# EasyEDA Pro project LeTalk智能语音音响.epro

# Schematic 主板
Board Name: 主板; Create Date: 2025-02-16; Page Name: 主控板; Project Name: LeTalk智能语音音响; Schematic Name: 主板; Update Date: 2025-02-16; Company: 延安大学西安创新学院; Drawed: 刘禛琪; Page Size: A4; Reviewed: 刘禛琪; Version: V8.0
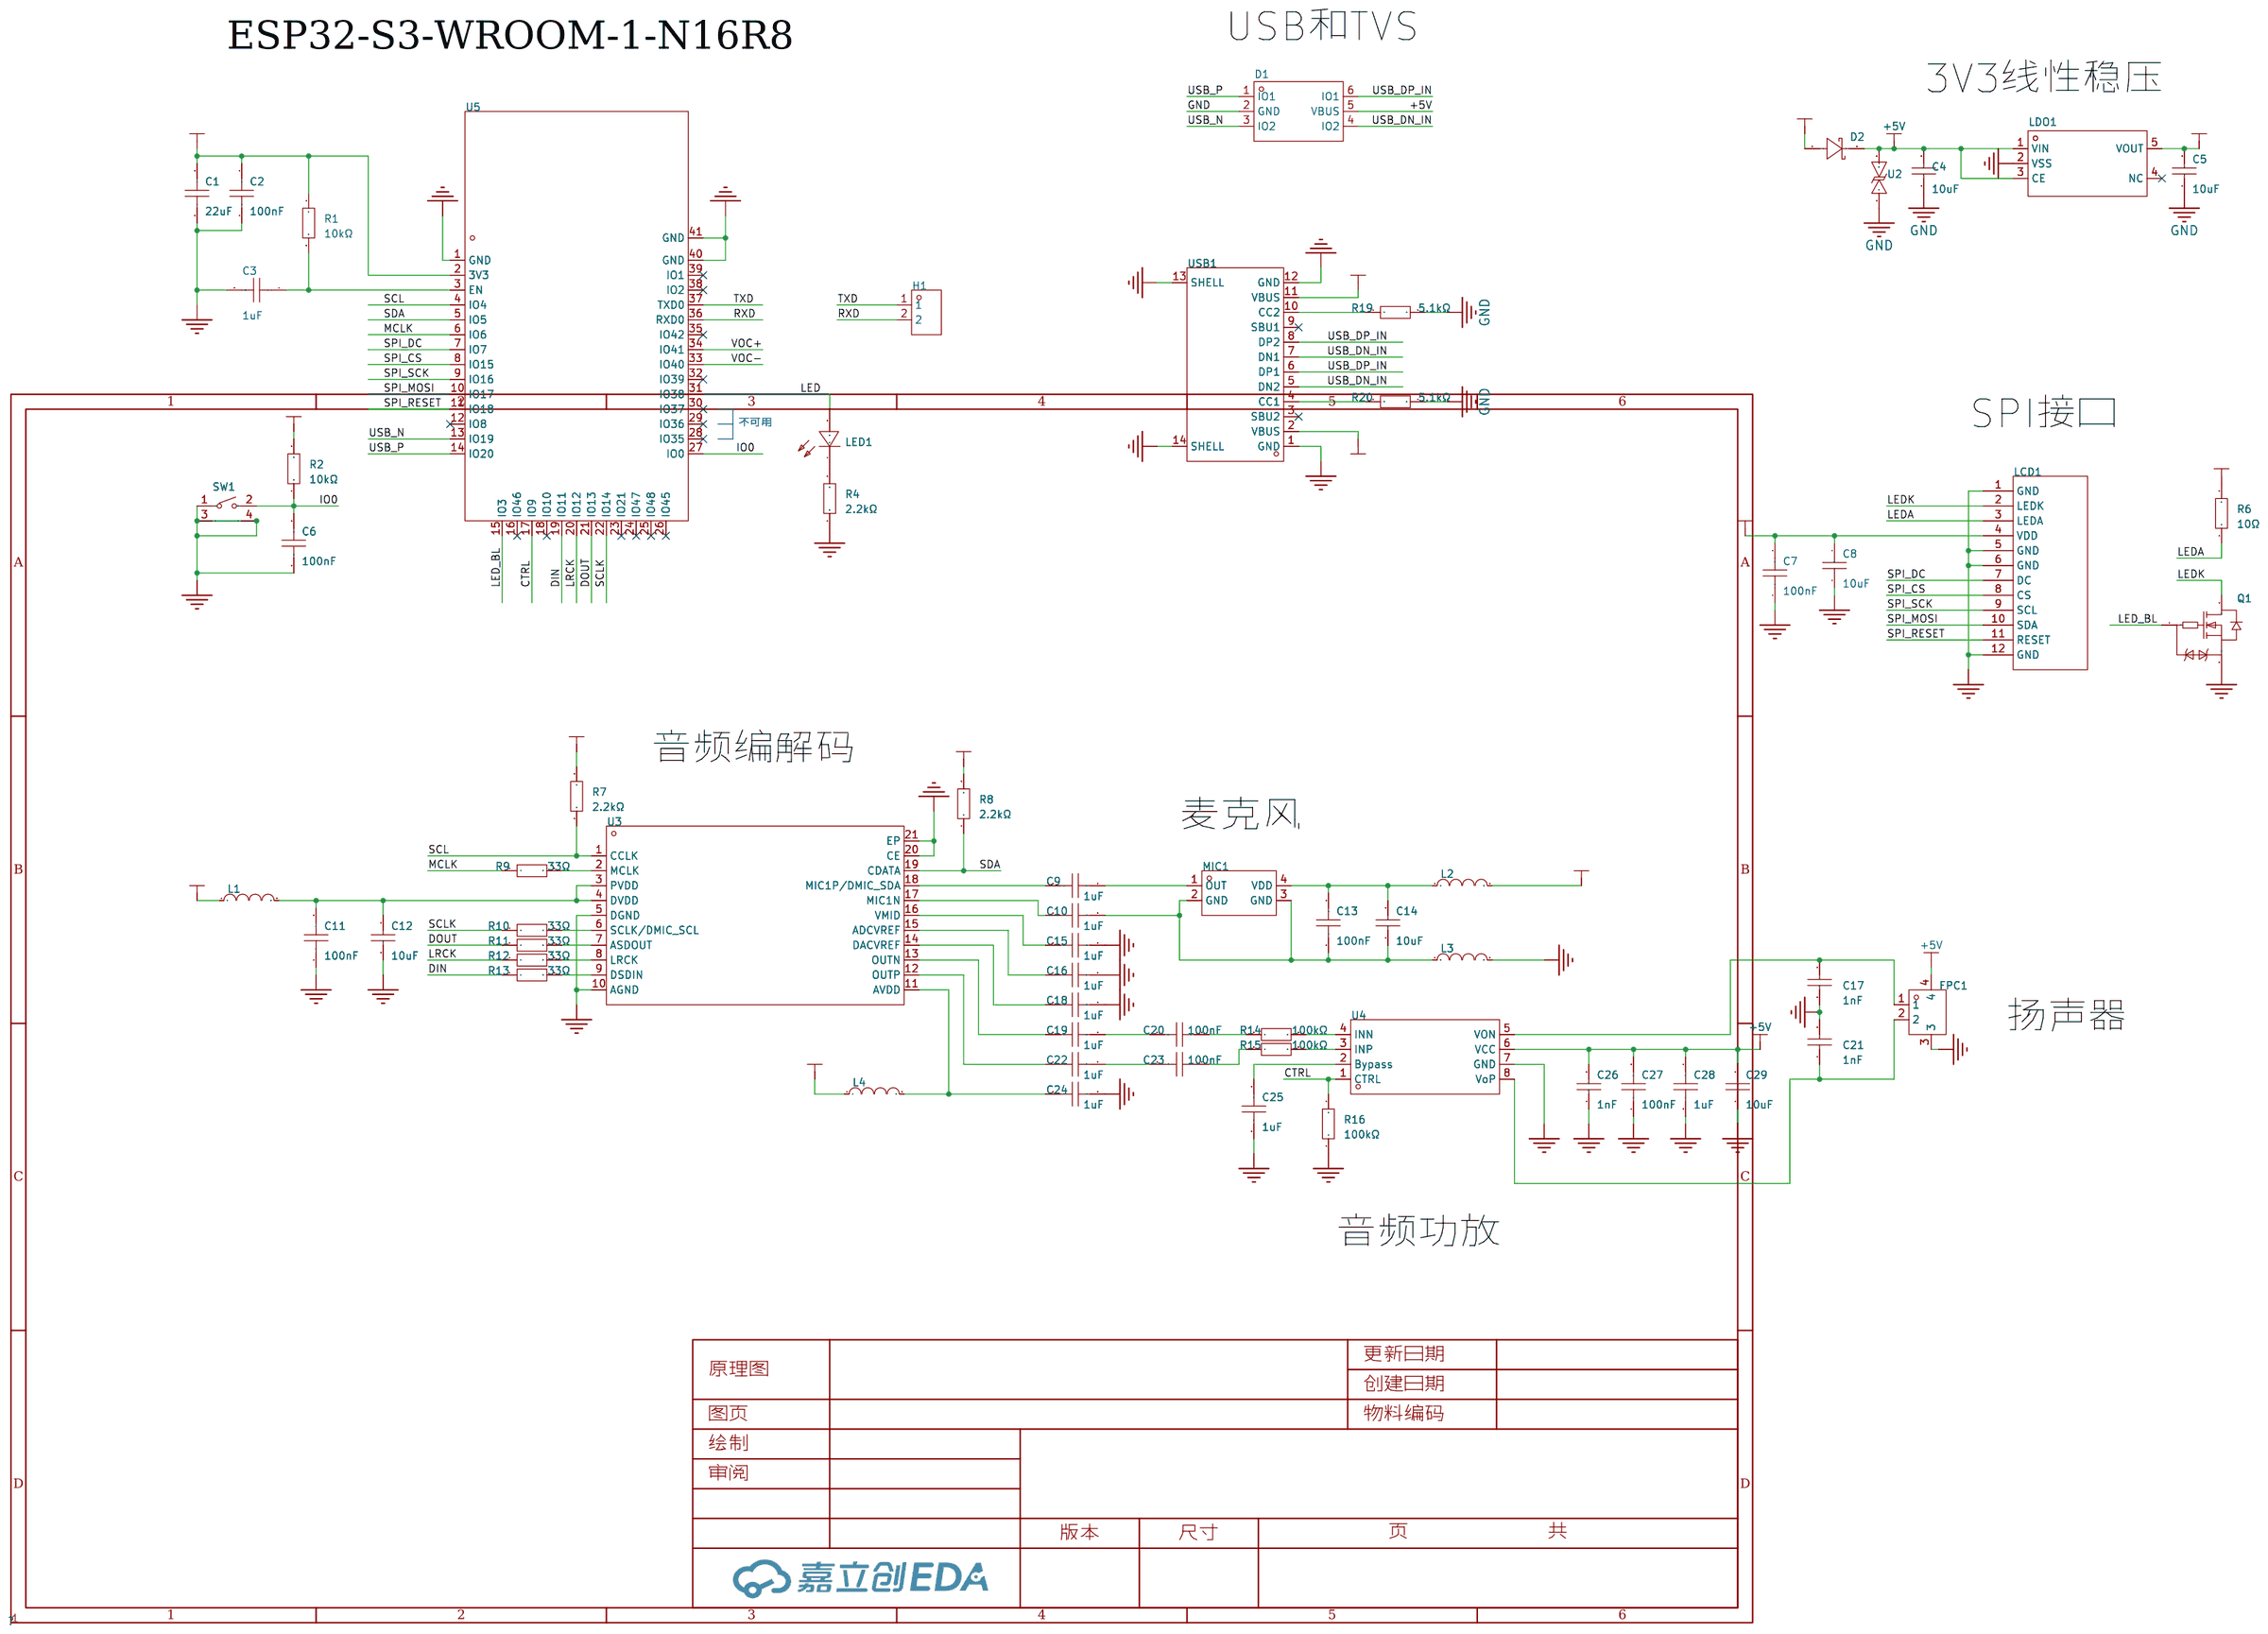
[diagram p0: schematic sheet]

## Parts
C1  22uF  [C0603]
C2  100nF  [C0402]
C3  1uF  [C0402]
C4  10uF  [C0402]
C5  10uF  [C0402]
C6  100nF  [C0402]
C7  100nF  [C0402]
C8  10uF  [C0402]
C9  1uF  [C0402]
C10  1uF  [C0402]
C11  100nF  [C0402]
C12  10uF  [C0402]
C13  100nF  [C0402]
C14  10uF  [C0402]
C15  1uF  [C0402]
C16  1uF  [C0402]
C17  1nF  [C0402]
C18  1uF  [C0402]
C19  1uF  [C0402]
C20  100nF  [C0402]
C21  1nF  [C0402]
C22  1uF  [C0402]
C23  100nF  [C0402]
C24  1uF  [C0402]
C25  1uF  [C0402]
C26  1nF  [C0402]
C27  100nF  [C0402]
C28  1uF  [C0402]
C29  10uF  [C0402]
D1  -  [SOT-23-6_L2.9-W1.6-P0.95-LS2.8-BL]
D2  B5819W  [SOD-123_L2.8-W1.8-LS3.7-FD-1]
FPC1  WAFER-MX1.25-2PWB  [CONN-SMD_2P-P1.25_XUNPU_WAFER-MX1.25-2PWB]
H1  PZ254V-11-02P  [HDR-TH_2P-P2.54-V-M]
L1  BLM15PX121SN1D  [L0402]
L2  BLM15PX121SN1D  [L0402]
L3  BLM15PX121SN1D  [L0402]
L4  BLM15PX121SN1D  [L0402]
LCD1  -  [YDP128H005-V3]
LDO1  ME6211C33M5G-N  [SOT-23-5_L3.0-W1.7-P0.95-LS2.8-BL]
LED1  TJ-S1706SW6TGLC6B-A5  [LED-SMD_L1.7-W0.6-RD]
MIC1  AP2718AT  [MIC-SMD_4P-L2.8-W1.9-P1.01-TL]
Q1  WNM6002-3/TR  [SOT-323-3_L2.0-W1.3-P1.30-LS2.1-BR]
R1  10kΩ  [R0402]
R2  10kΩ  [R0402]
R4  2.2kΩ  [R0402]
R6  10Ω  [R0402]
R7  2.2kΩ  [R0402]
R8  2.2kΩ  [R0402]
R9  33Ω  [R0402]
R10  33Ω  [R0402]
R11  33Ω  [R0402]
R12  33Ω  [R0402]
R13  33Ω  [R0402]
R14  100kΩ  [R0402]
R15  100kΩ  [R0402]
R16  100kΩ  [R0402]
R19  5.1kΩ  [R0402]
R20  5.1kΩ  [R0402]
SW1  GT-TC191A-H026-L60  [KEY-SMD_GT-TC191A-H026-L60]
U2  SYT01N05DWC  [DFN-2L_L1.0-W0.6-P0.65-BI-2]
U3  ES8311  [WQFN-20_L3.0-W3.0-P0.40-BL-EP1.7]
U4  NS4150B  [MSOP-8_L3.0-W3.0-P0.65-LS5.0-BL]
U5  ESP32-S3-WROOM-1-N16R8  [WIRELM-SMD_ESP32-S3-WROOM-1]
USB1  TYPE-C 16PIN 2MD(073)  [USB-C-SMD_TYPE-C-6PIN-2MD-073]

## Library data of the parts
C1 = CL10A226MP8NUNE: 温度系数:X5R;精度:±20%;额定电压:10V;容值:22uF;; LCSC Part Name: 22uF(226) ±20% 10V; Supplier Part: C86295; Manufacturer: SAMSUNG(三星); Supplier Footprint: 0603; JLCPCB Part Class: 扩展库; Datasheet: https://atta.szlcsc.com/upload/public/pdf/source/20170325/1490427882169.pdf; Supplier: LCSC; Temperature Coefficient: X5R; Tolerance: ±20%; Voltage Rated: 10V
C2 C6 = CC0402KRX7R7BB104: 容值:100nF;精度:±10%;额定电压:16V;材质(温度系数):X7R;; LCSC Part Name: 100nF ±10% 16V; Supplier Part: C60474; Manufacturer: YAGEO(国巨); Supplier Footprint: 0402; JLCPCB Part Class: 扩展库; Datasheet: https://atta.szlcsc.com/upload/public/pdf/source/20211223/9278FD768280B81DDBEF48FA36411A03.pdf; Supplier: LCSC; Tolerance: ±10%; Voltage Rated: 16V; Temperature Coefficient: X7R
C3 C9 C10 C15 C16 C18 C19 C22 C24 C25 C28 = CL05A105KA5NQNC: 容值:1uF;精度:±10%;额定电压:25V;材质(温度系数):X5R;; LCSC Part Name: 1uF ±10% 25V; Supplier Part: C52923; Manufacturer: SAMSUNG(三星); Supplier Footprint: 0402; JLCPCB Part Class: 基础库; Datasheet: https://atta.szlcsc.com/upload/public/pdf/source/20160218/1457707763339.pdf; Supplier: LCSC; Tolerance: ±10%; Voltage Rated: 25V; Temperature Coefficient: X5R
C4 C5 C8 C12 C14 C29 = CL05A106MQ5NUNC: 容值:10uF;精度:±20%;额定电压:6.3V;材质(温度系数):X5R;; LCSC Part Name: 10uF ±20% 6.3V; Supplier Part: C15525; Manufacturer: SAMSUNG(三星); Supplier Footprint: 0402; JLCPCB Part Class: 基础库; Datasheet: https://atta.szlcsc.com/upload/public/pdf/source/20220823/2B02EE04F8F211D38A52DCB16EB6BEBA.pdf; Supplier: LCSC; Tolerance: ±20%; Voltage Rated: 6.3V; Temperature Coefficient: X5R
C7 C11 C13 C20 C23 C27 = CC0402KRX7R7BB104: 容值:100nF;精度:±10%;额定电压:16V;材质(温度系数):X7R;; LCSC Part Name: 100nF ±10% 16V; Supplier Part: C60474; Manufacturer: YAGEO(国巨); Supplier Footprint: 0402; JLCPCB Part Class: Extended Part; Datasheet: https://atta.szlcsc.com/upload/public/pdf/source/20211223/9278FD768280B81DDBEF48FA36411A03.pdf; Supplier: LCSC; Tolerance: ±10%; Voltage Rated: 16V; Temperature Coefficient: X7R
C17 C21 C26 = CC0402KRX7R9BB102: 容值:1nF;精度:±10%;额定电压:50V;材质(温度系数):X7R;; LCSC Part Name: 1nF ±10% 50V; Supplier Part: C106205; Manufacturer: YAGEO(国巨); Supplier Footprint: 0402; JLCPCB Part Class: Extended Part; Datasheet: https://atta.szlcsc.com/upload/public/pdf/source/20181008/C309510_22F155564471FAF6A489F7D68F34234E.pdf; Supplier: LCSC; Tolerance: ±10%; Voltage Rated: 50V; Temperature Coefficient: X7R
D1 = USBLC6-2SC6: 极性:-;反向关断电压（典型值）:-;击穿电压（最小值）:-;箝位电压:-;峰值脉冲电流（10/1000us）:-;; Supplier Part: C2827654; Manufacturer: TECH PUBLIC(台舟); Supplier Footprint: SOT-23-6; JLCPCB Part Class: Extended Part; Datasheet: https://atta.szlcsc.com/upload/public/pdf/source/20210810/FBD75DE717D6D97BAC6DD7F2B5C09DCD.pdf; Supplier: LCSC
D2 = B5819W_C908224: 二极管配置:-;正向压降(Vf):900mV@3A;直流反向耐压(Vr):40V;整流电流:1A;; LCSC Part Name: 电压:40V 电流:1A; Supplier Part: C908224; Manufacturer: FUXINSEMI(富芯森美); Supplier Footprint: SOD-123; JLCPCB Part Class: 扩展库; Datasheet: https://atta.szlcsc.com/upload/public/pdf/source/20201027/C908224_73D10151B1A2DD88F16405F55CA93B30.pdf; Supplier: LCSC; Forward Voltage (Vf@If): 900mV@3A; Reverse Voltage (Vr): 40V; Rectified Current: 1A; Reverse Leakage Current (Ir): 1mA@40V
FPC1 = WAFER-MX1.25-2PWB: 插针结构:1x2P;间距:1.25mm;安装方式:卧贴;总PIN数:2P;排数:1;每排PIN数:2;额定电流:1A;工作温度范围:-25℃~+85℃;; LCSC Part Name: 1x2P 间距:1.25mm 卧贴; Supplier Part: C3029359; Manufacturer: XUNPU(讯普); Supplier Footprint: SMD,P=1.25mm,卧贴; JLCPCB Part Class: 扩展库; Datasheet: https://atta.szlcsc.com/upload/public/pdf/source/20220527/5ACBB683E384B6AD06743F272F933620.pdf; Supplier: LCSC; Pins Structure: 1x2P; Pitch: 1.25mm; Mounting Style: 卧贴; Number of Pins: 2P; Number of Rows: 1; Number of PINs Per Row: 2; Current Rating (Max): 1A; Operating Temperature Range: -25℃~+85℃
H1 = PZ254V-11-02P: 插针结构:1x2P;间距:2.54mm;行距:-;圆针/方针:方针;安装类型:直插;排数:单排;总PIN位数:2P;额定电流:-;额定电压:-;配合针长度:6mm;塑高:2.5mm;端接针长度:3mm;触头材质:黄铜;触头镀层:-;工作温度范围:-40℃~+105℃;颜色:黑色;; LCSC Part Name: 间距:2.54mm 1x2P 直插 方针; Supplier Part: C492401; Manufacturer: XFCN(兴飞); Supplier Footprint: 插件,P=2.54mm; JLCPCB Part Class: 扩展库; Datasheet: https://atta.szlcsc.com/upload/public/pdf/source/20200309/C492401_A812433581A9B211A7FFA413ADDFF0E5.pdf; Supplier: LCSC; Pin Structure: 1x2P; Pitch: 2.54mm; Circluar Pins/Square Pins: 方针; Mounting Type: 直插; Number of Rows: 单排; Number of Pins: 2P; Length of Mating Pin: 6mm; Insulation Height: 2.5mm; Length of End Connection Pin: 3mm; Contact Material: 黄铜; Operating Temperature Range: -40℃~+105℃; Color: 黑色
L1-L4 = BLM15PX121SN1D: 标称阻抗@测试频率:120Ω@100MHz;误差:±25%;直流电阻(DCR):55mΩ;; LCSC Part Name: 单路 0402磁珠 阻抗120Ω@100MHz; Supplier Part: C88970; Manufacturer: muRata(村田); Supplier Footprint: 0402; JLCPCB Part Class: 扩展库; Datasheet: https://atta.szlcsc.com/upload/public/pdf/source/20181120/C333978_3E581FB55966932B05020139ABDE8E01.pdf; Supplier: LCSC; Impedance @ Frequency: 120Ω@100MHz; Tolerance: ±25%; DC Resistance: 55mΩ; Current Rating: 2A; Circuits: 1
LCD1 = YDP128H005-V3: 1.28"/GC9A01/240x240; Check: false
LDO1 = ME6211C33M5G-N: 输出类型:固定;输出极性:正;最大输入电压:6V;输出电压:3.3V;输出电流:500mA;电源纹波抑制比(PSRR):70dB;; Supplier Part: C82942; Manufacturer: MICRONE(南京微盟); Supplier Footprint: SOT-23-5; Datasheet: https://atta.szlcsc.com/upload/public/pdf/source/20170918/C82942_1505727073070976520.pdf; Supplier: LCSC; Output Type: 固定; Output Polarity: 正; Number of Outputs: 1; Maximum Input Voltage: 6V; Output Voltage: 3.3V; Dropout Voltage: 260mV@(200mA); Output Current: 500mA; Power Supply Rejection Ratio (PSRR): 70dB
LED1 = TJ-S1706SW6TGLC6B-A5: 发光颜色:蓝色;; LCSC Part Name: 蓝灯; Supplier Part: C273617; Manufacturer: TOGIALED(统佳); Supplier Footprint: 0603; JLCPCB Part Class: 扩展库; Datasheet: https://atta.szlcsc.com/upload/public/pdf/source/20180904/C273617_010B6E63EA0A9F3D2D95851617E75532.pdf; Supplier: LCSC; Emitted Color: 蓝色
MIC1 = AP2718AT: 方向:全指向;信噪比:57dB;灵敏度:-42dB;阻抗:220Ω;; Supplier Part: C918197; Manufacturer: ALLPOWER(铨力); Supplier Footprint: SMD-4P,1.9x2.8mm; JLCPCB Part Class: 扩展库; Datasheet: https://atta.szlcsc.com/upload/public/pdf/source/20201117/C918197_916D2310AF560C68E9F1DD4012181D7B.pdf; Supplier: LCSC; Direction: 全指向; Supply Voltage: 1.6V~3.6V; Current Consumption: 95uA; SNR(Signal to Noise Ratio): 57dB; Sensitivity: -42dB; Impedance: 220Ω
Q1 = WNM6002-3/TR: 类型:1个N沟道;漏源电压(Vdss):60V;连续漏极电流(Id):300mA;导通电阻(RDS(on)@Vgs,Id):1.7Ω@4.5V,0.2A;功率(Pd):270mW;阈值电压(Vgs(th)@Id):800mV@250uA;; LCSC Part Name: 1个N沟道 耐压:60V 电流:300mA; Supplier Part: C501342; Manufacturer: WILLSEMI(韦尔); Supplier Footprint: SOT-323-3; JLCPCB Part Class: 扩展库; Datasheet: https://atta.szlcsc.com/upload/public/pdf/source/20200324/C501342_29E9D9C6E1199381F55B20D6C6C9F64A.pdf; Supplier: LCSC; Type: 1个N沟道; Drain Source Voltage (Vdss): 60V; Continuous Drain Current (Id): 300mA; Drain Source On Resistance (RDS(on)@Vgs,Id): 1.7Ω@4.5V,0.2A; Power Dissipation (Pd): 270mW; Gate Threshold Voltage (Vgs(th)@Id): 800mV@250uA; Total Gate Charge (Qg@Vgs): 1.2nC@10V; Input Capacitance (Ciss@Vds): 23.37pF; Reverse Transfer Capacitance (Crss@Vds): 5.2pF@25V; Operating Temperature: -55℃~+150℃; Configuration: 共源
R1 R2 = 0402WGF1002TCE: 电阻类型:厚膜电阻;阻值:10kΩ;精度:±1%;功率:62.5mW;最大工作电压:50V;温度系数:±100ppm/℃;; LCSC Part Name: 10kΩ ±1% 62.5mW 厚膜电阻; Supplier Part: C25744; Manufacturer: UNI-ROYAL(厚声); Supplier Footprint: 0402; JLCPCB Part Class: 基础库; Datasheet: https://atta.szlcsc.com/upload/public/pdf/source/20200306/C422600_1E6D84923E4A46A82E41ADD87F860B5C.pdf; Supplier: LCSC; Type: 厚膜电阻; Tolerance: ±1%; Power(Watts): 62.5mW; Overload Voltage (Max): 50V; Temperature Coefficient: ±100ppm/℃; Operating Temperature Range: -55℃~+155℃
R4 R7 R8 = 0402WGF2201TCE: 电阻类型:厚膜电阻;阻值:2.2kΩ;精度:±1%;功率:62.5mW;最大工作电压:50V;温度系数:±100ppm/℃;; LCSC Part Name: 2.2kΩ ±1% 62.5mW 厚膜电阻; Supplier Part: C25879; Manufacturer: UNI-ROYAL(厚声); Supplier Footprint: 0402; JLCPCB Part Class: 基础库; Datasheet: https://atta.szlcsc.com/upload/public/pdf/source/20200306/C422600_1E6D84923E4A46A82E41ADD87F860B5C.pdf; Supplier: LCSC; Type: 厚膜电阻; Tolerance: ±1%; Power(Watts): 62.5mW; Overload Voltage (Max): 50V; Temperature Coefficient: ±100ppm/℃; Operating Temperature Range: -55℃~+155℃
R6 = 0402WGF100JTCE: 电阻类型:厚膜电阻;阻值:10Ω;精度:±1%;功率:62.5mW;最大工作电压:50V;温度系数:±200ppm/℃;; LCSC Part Name: 10Ω ±1% 62.5mW 厚膜电阻; Supplier Part: C25077; Manufacturer: UNI-ROYAL(厚声); Supplier Footprint: 0402; JLCPCB Part Class: 基础库; Datasheet: https://atta.szlcsc.com/upload/public/pdf/source/20200306/C422600_1E6D84923E4A46A82E41ADD87F860B5C.pdf; Supplier: LCSC; Type: 厚膜电阻; Tolerance: ±1%; Power(Watts): 62.5mW; Overload Voltage (Max): 50V; Temperature Coefficient: ±200ppm/℃; Operating Temperature Range: -55℃~+155℃
R9-R13 = 0402WGF330JTCE: 电阻类型:厚膜电阻;阻值:33Ω;精度:±1%;功率:62.5mW;最大工作电压:50V;温度系数:±100ppm/℃;; LCSC Part Name: 33Ω ±1% 62.5mW 厚膜电阻; Supplier Part: C25105; Manufacturer: UNI-ROYAL(厚声); Supplier Footprint: 0402; JLCPCB Part Class: 基础库; Datasheet: https://atta.szlcsc.com/upload/public/pdf/source/20200306/C422600_1E6D84923E4A46A82E41ADD87F860B5C.pdf; Supplier: LCSC; Type: 厚膜电阻; Tolerance: ±1%; Power(Watts): 62.5mW; Overload Voltage (Max): 50V; Temperature Coefficient: ±100ppm/℃; Operating Temperature Range: -55℃~+155℃
R14-R16 = RC0402FR-07100KL: 电阻类型:厚膜电阻;阻值:100kΩ;精度:±1%;功率:62.5mW;最大工作电压:50V;温度系数:±100ppm/℃;; LCSC Part Name: 厚膜电阻 100kΩ ±1% 62.5mW; Supplier Part: C60491; Manufacturer: YAGEO(国巨); Supplier Footprint: 0402; JLCPCB Part Class: 扩展库; Datasheet: https://atta.szlcsc.com/upload/public/pdf/source/20180927/C295883_E8D83085EA81BD7DE0B2B681138C15EE.pdf; Supplier: LCSC; Type: 厚膜电阻; Tolerance: ±1%; Power(Watts): 62.5mW; Overload Voltage (Max): 50V; Temperature Coefficient: ±100ppm/℃; Operating Temperature Range: -55℃~+155℃
R19 R20 = RMC04025.1K1%N: 阻值:5.1kΩ;精度:±1%;功率:62.5mW;; LCSC Part Name: 5.1kΩ ±1% 62.5mW; Supplier Part: C325521; Manufacturer: Tyohm(幸亚电阻); Supplier Footprint: 0402; JLCPCB Part Class: 扩展库; Datasheet: https://atta.szlcsc.com/upload/public/pdf/source/20190115/C325521_1EC5F156994D781C7E2B08432302F19F.pdf; Supplier: LCSC; Tolerance: ±1%; Power(Watts): 62.5mW
SW1 = GT-TC191A-H026-L60: 电路结构:单刀单掷;按钮形状:圆形按钮;作用力:1.8N;安装方式:卧贴;开关长度:2.2mm;开关宽度:4.5mm;开关高度:2.6mm;带支架:不带;触点电流:50mA;额定电压(DC):12V;绝缘电阻:100MΩ;带灯:无;机械寿命:10万次;; LCSC Part Name: 2.2*4.5*2.6mm 卧贴 轻触开关; Supplier Part: C2890363; Manufacturer: G-Switch(品赞); Supplier Footprint: SMD; JLCPCB Part Class: 扩展库; Datasheet: https://atta.szlcsc.com/upload/public/pdf/source/20210903/827026A73FC85D31E29B802EE66DB347.pdf; Supplier: LCSC; Circuit: 单刀单掷; Actuator Style: 圆形按钮; Operating Force: 1.8N; Mounting Style: 卧贴; Switch Length: 2.2mm; Switch Width: 4.5mm; Switch Height: 2.6mm; Strike Gundam: 不带; Contact Current: 50mA; Voltage Rating (DC): 12V; Insulation Resistance: 100MΩ; Actuator/Cap Color: 黑色; With Lamp: 无; Pin Style: SMD接片; Mechanical Life: 10万次; Operating Temperature: -30℃~+85℃
U2 = SYT01N05DWC: Supplier Part: C3151913; Manufacturer: silergy(矽力杰); Supplier Footprint: DFN1006; JLCPCB Part Class: 扩展库; Datasheet: https://atta.szlcsc.com/upload/public/pdf/source/20220628/9319FA8A9E353BCA4B9F968BBD562652.pdf; Supplier: LCSC
U3 = ES8311: Supplier Part: C962342; Manufacturer: Everest-semi(顺芯); Supplier Footprint: WQFN-20-EP(3x3); JLCPCB Part Class: 扩展库; Datasheet: https://atta.szlcsc.com/upload/public/pdf/source/20210630/C962342_E665EAE7274179BC7C5A390EC8AC685C.pdf; Supplier: LCSC
U4 = NS4150B_C189961: 功放类型:D类功放;输出功率:3Wx1@4Ω;; Supplier Part: C189961; Manufacturer: Nsiway(纳芯威); Supplier Footprint: MSOP-8; JLCPCB Part Class: 扩展库; Datasheet: https://atta.szlcsc.com/upload/public/pdf/source/20220916/DAE631F3909B9CBB38BDE76E3E6D5896.pdf; Supplier: LCSC; Type of Power Amplifier: D类功放; Output Power: 3Wx1@4Ω; Supply Voltage: 3V~5.25V
U5 = ESP32-S3-WROOM-1-N16R8: LCSC Part Name: 通用型Wi-Fi+低功耗蓝牙MCU模组; Supplier Part: C2913202; Manufacturer: ESPRESSIF(乐鑫); Supplier Footprint: SMD,18x25.5mm; JLCPCB Part Class: 扩展库; Datasheet: https://atta.szlcsc.com/upload/public/pdf/source/20220705/4E799F39581577F766659887F738A439.pdf; Supplier: LCSC
USB1 = TYPE-C 16PIN 2MD(073): 连接器类型:Type-C;标准:USB 3.1;公母:母;安装方式:卧贴;触点数量:16P;端口数量:1;额定电流 - 电源:5A;工作温度范围:-25℃~+85℃;; LCSC Part Name: Type-C 母 卧贴; Supplier Part: C2765186; Manufacturer: SHOU HAN(首韩); Supplier Footprint: SMD; JLCPCB Part Class: 扩展库; Datasheet: https://atta.szlcsc.com/upload/public/pdf/source/20211123/39B17C16241EAC15C5E277BDA434118E.pdf; Supplier: LCSC; Connector Type: Type-C; Standard: USB 3.1; Gender: 母; Mounting Style: 卧贴; Number of Contacts: 16P; Number of Ports: 1; Current Rating - Power (Max): 5A; Operating Temperature Range: -25℃~+85℃; Rated Voltage (Max): 5V; Connect-Disconnect Life: 5千次; Core Colour: 黑色

## Nets
+3V3: C1.2 C2.2 C5.2 C7.2 C8.2 L1.1 L2.2 L4.1 LCD1.4(VDD) LDO1.5(VOUT) R1.1 R2.2 R6.2 R7.2 R8.2 U5.2(3V3)
+5V: C4.2 C26.2 C27.2 C28.1 C29.2 D1.5(VBUS) D2.2(K) FPC1.4 LDO1.1(VIN) LDO1.3(CE) U2.2 U4.6(VCC)
GND: C1.1 C2.1 C3.2 C4.1 C5.1 C6.1 C7.1 C8.1 C11.1 C12.1 C15.2 C16.2 C17.1 C18.2 C21.2 C24.2 C25.2 C26.1 C27.1 C28.2 C29.1 D1.2(GND) FPC1.3 L3.2 LCD1.1(GND) LCD1.5(GND) LCD1.6(GND) LCD1.12(GND) LDO1.2(VSS) Q1.2(S) R4.2 R16.1 R19.2 R20.2 SW1.1 SW1.3 SW1.4 U2.1 U3.5(DGND) U3.10(AGND) U3.20(CE) U3.21(EP) U4.7(GND) U5.1(GND) U5.40(GND) U5.41(GND) USB1.1(GND) USB1.12(GND) USB1.13(SHELL) USB1.14(SHELL)
VBUS: D2.1(A) USB1.2(VBUS) USB1.11(VBUS)
CTRL: R16.2 U4.1(CTRL) U5.17(IO9)
DIN: R13.1 U5.19(IO11)
DOUT: R11.1 U5.21(IO13)
IO0: C6.2 R2.1 SW1.2 U5.27(IO0)
LED: LED1.2 U5.31(IO38)
LED_BL: Q1.1(G) U5.15(IO3)
LEDA: LCD1.3(LEDA) R6.1
LEDK: LCD1.2(LEDK) Q1.3(D)
LRCK: R12.1 U5.20(IO12)
MCLK: R9.1 U5.6(IO6)
RXD: H1.2 U5.36(RXD0)
SCL: R7.1 U3.1(CCLK) U5.4(IO4)
SCLK: R10.1 U5.22(IO14)
SDA: R8.1 U3.19(CDATA) U5.5(IO5)
SPI_CS: LCD1.8(CS) U5.8(IO15)
SPI_DC: LCD1.7(DC) U5.7(IO7)
SPI_MOSI: LCD1.10(SDA) U5.10(IO17)
SPI_RESET: LCD1.11(RESET) U5.11(IO18)
SPI_SCK: LCD1.9(SCL) U5.9(IO16)
TXD: H1.1 U5.37(TXD0)
USB_DN_IN: D1.4(IO2) USB1.5(DN2) USB1.7(DN1)
USB_DP_IN: D1.6(IO1) USB1.6(DP1) USB1.8(DP2)
USB_N: D1.3(IO2) U5.13(IO19)
USB_P: D1.1(IO1) U5.14(IO20)
VOC+: U5.34(IO41)
VOC-: U5.33(IO40)
$1N3371: C9.1 U3.18(MIC1P/DMIC_SDA)
$1N3372: C10.1 U3.17(MIC1N)
$1N3373: C15.1 U3.16(VMID)
$1N3374: C16.1 U3.15(ADCVREF)
$1N3375: C18.1 U3.14(DACVREF)
$1N3376: C19.1 U3.13(OUTN)
$1N3377: C22.1 U3.12(OUTP)
$1N3378: C24.1 L4.2 U3.11(AVDD)
$1N3384: R9.2 U3.2(MCLK)
$1N3385: C11.2 C12.2 L1.2 U3.3(PVDD) U3.4(DVDD)
$1N3387: R10.2 U3.6(SCLK/DMIC_SCL)
$1N3388: R11.2 U3.7(ASDOUT)
$1N3389: R12.2 U3.8(LRCK)
$1N3390: R13.2 U3.9(DSDIN)
$1N3393: C13.2 C14.2 L2.1 MIC1.4(VDD)
$1N3395: C9.2 MIC1.1(OUT)
$1N3413: R14.2 U4.4(INN)
$1N3415: R15.2 U4.3(INP)
$1N3417: C22.2 C23.2
$1N3418: C25.1 U4.2(Bypass)
$1N3429: C21.1 FPC1.2 U4.8(VoP)
$1N3430: C17.2 FPC1.1 U4.5(VON)
$1N5880: C19.2 C20.2
$1N5884: C20.1 R14.1
$1N5889: C23.1 R15.1
$1N5925: C10.2 C13.1 C14.1 L3.1 MIC1.2(GND) MIC1.3(GND)
$1N9910: R19.1 USB1.10(CC2)
$1N9913: R20.1 USB1.4(CC1)
$1N10459: LED1.1 R4.1
$1N10799: C3.1 R1.2 U5.3(EN)

Not connected (* = marked no-connect by the designer): LDO1 4(NC)*; U5 12(IO8)* 16(IO46)* 18(IO10)* 23(IO21)* 24(IO47)* 25(IO48)* 26(IO45)* 28(IO35)* 29(IO36)* 30(IO37)* 32(IO39)* 35(IO42)* 38(IO2)* 39(IO1)*; USB1 3(SBU2)* 9(SBU1)*

## Notes on the sheet
- USB和TVS
- ESP32-S3-WROOM-1-N16R8
- 3V3线性稳压
- 不可用
- SPI接口
- 音频编解码
- 麦克风
- 扬声器
- 音频功放

# Board PCB1
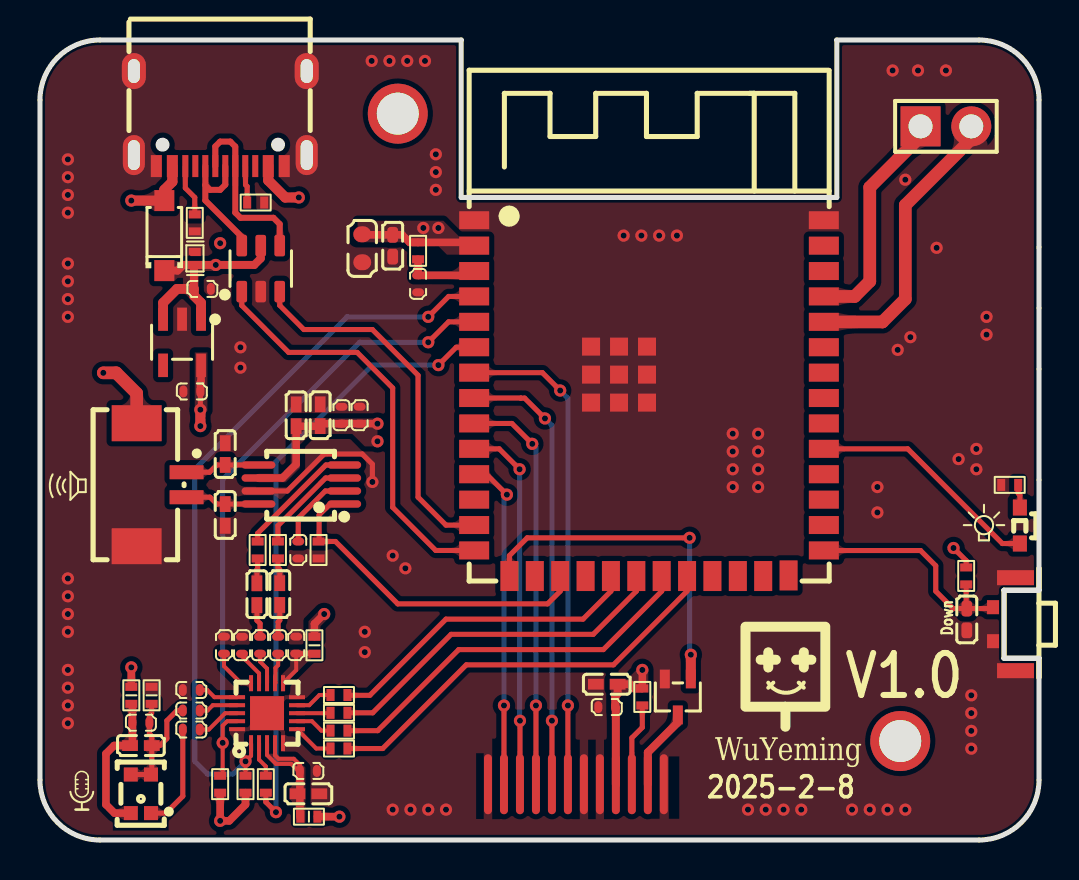
[diagram p1: board, top side]
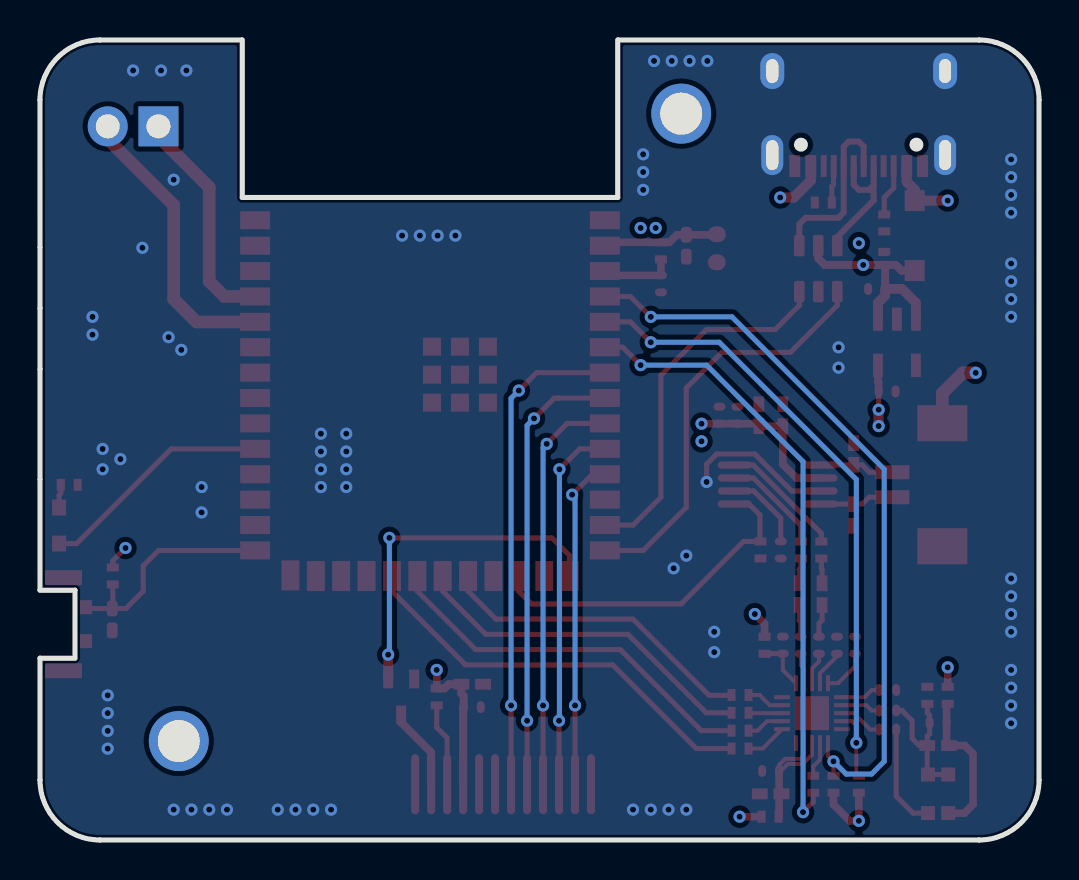
[diagram p2: board, bottom side, seen from below]

Outline 50 x 40 mm; copper layers: Top Layer, GND, VDD, Bottom Layer. Coordinates in mm from the lower left corner of the outline.
Outline path: 0,37 0,3 arc(0.88,0.88) 3,0 47,0 arc(49.12,0.88) 50,3 50,9.09 48.25,9.09 48.25,12.49 50,12.49 50,29.64 50,37 arc(49.12,39.12) 47,40 39.88,40 39.88,32.13 21.08,32.13 21.08,40 3,40 arc(0.88,39.12) 0,37
Stack: Top Layer 0.035mm 外层铜厚1oz / Dielectric1 0.2104mm 7628 RC49% 8.6mil / GND 0.035mm / Dielectric2 1.065mm 1.1mm H/HOZ Copper / VDD 0.035mm / Dielectric3 0.2104mm 7628 RC49% 8.6mil / Bottom Layer 0.035mm 外层铜厚1oz

## Design rules (mm)
template: 自定义配置
spacing copperThickness1oz (default): track to track 0.102, other pairs 0.152 to 0.3
spacing copperThickness2oz: track to track 0.203, other pairs 0.152 to 0.3
track width copperThickness1oz (default): min 0.127, default 0.254, max 2.54
track width copperThickness2oz: min 0.203, default 0.254, max 2.54
differential pair differentialPair (default): width min 0.127, default 0.254, max 2.54; gap min 0.152, default 0.152
via viaSize (default): diameter min 0.432, default 0.61, max 10; hole min 0.229, default 0.305, max 6.299

## Placement (name value [footprint] x y rotation side)
C1  22uF  [C0603]  16.13 29.59 90 top
C2  100nF  [C0402]  17.65 29.71 90 top
C3  1uF  [C0402#2]  18.92 27.81 270 top
C4  10uF  [C0402#2]  8.13 27.55 180 top
C5  10uF  [C0402#2]  7.6 22.43 0 top
C6  100nF  [C0402]  46.38 11.03 90 top
C7  100nF  [C0402#3]  28.37 7.79 0 top
C8  10uF  [C0402#2]  28.37 6.65 0 top
C9  1uF  [C0402#2]  7.57 5.52 180 top
C10  1uF  [C0402#2]  7.57 6.48 180 top
C11  100nF  [C0402#3]  13.43 2.31 180 top
C12  10uF  [C0402#2]  13.43 3.45 180 top
C13  100nF  [C0402#3]  5.05 4.72 180 top
C14  10uF  [C0402#2]  5.05 5.87 180 top
C15  1uF  [C0402#2]  7.57 7.5 180 top
C16  1uF  [C0402#2]  9.21 9.74 90 top
C17  1nF  [C0402#3]  9.27 19.3 270 top
C18  1uF  [C0402#2]  10.11 9.74 90 top
C19  1uF  [C0402#2]  11.02 9.74 90 top
C20  100nF  [C0402#3]  10.86 12.29 270 top
C21  1nF  [C0402#3]  9.27 16.25 270 top
C22  1uF  [C0402#2]  11.92 9.74 90 top
C23  100nF  [C0402#3]  12 12.3 270 top
C24  1uF  [C0402#2]  12.82 9.74 90 top
C25  1uF  [C0402#2]  12.93 14.5 270 top
C26  1nF  [C0402#3]  12.82 21.24 270 top
C27  100nF  [C0402#3]  14.02 21.24 270 top
C28  1uF  [C0402#2]  15.09 21.24 90 top
C29  10uF  [C0402#2]  16 21.24 270 top
D1  -  [SOT-23-6_L2.9-W1.6-P0.95-LS2.8-BL]  11.05 28.57 0 top
D2  B5819W  [SOD-123_L2.8-W1.8-LS3.7-FD-1]  6.22 30.22 270 top
FPC1  WAFER-MX1.25-2PWB  [CONN-SMD_2P-P1.25_XUNPU_WAFER-MX1.25-2PWB]  6.09 17.76 270 top
H1  PZ254V-11-02P  [HDR-TH_2P-P2.54-V-M]  45.34 35.68 0 top
L1  BLM15PX121SN1D  [L0402]  13.46 1.17 180 top
L2  BLM15PX121SN1D  [L0402]  4.57 7.23 90 top
L3  BLM15PX121SN1D  [L0402]  5.59 7.23 90 top
L4  BLM15PX121SN1D  [L0402]  13.74 9.74 270 top
LCD1  -  [YDP128H005-V3]  31.22 2.79 180 top
LDO1  ME6211C33M5G-N  [SOT-23-5_L3.0-W1.7-P0.95-LS2.8-BL]  7.11 24.89 180 top
LED1  TJ-S1706SW6TGLC6B-A5  [LED-SMD_L1.7-W0.6-RD]  49.04 15.72 270 top
MIC1  AP2718AT  [MIC-SMD_4P-L2.8-W1.9-P1.01-TL]  5.05 2.31 180 top
NOREF  -  [Pad_e1540]  17.91 36.32 0 top
NOREF#2  -  [Pad_e1495]  43.05 4.95 0 top
Q1  WNM6002-3/TR  [SOT-323-3_L2.0-W1.3-P1.30-LS2.1-BR]  31.92 7.15 90 top
R1  10kΩ  [R0402]  18.92 29.46 270 top
R2  10kΩ  [R0402]  46.36 13.2 90 top
R4  2.2kΩ  [R0402]  48.53 17.76 180 top
R6  10Ω  [R0402]  30.14 7.15 90 top
R7  2.2kΩ  [R0402]  10.29 2.79 270 top
R8  2.2kΩ  [R0402]  9.02 2.79 270 top
R9  33Ω  [R0402]  11.3 2.79 90 top
R10  33Ω  [R0402]  14.96 4.57 180 top
R11  33Ω  [R0402]  14.96 5.47 180 top
R12  33Ω  [R0402]  14.96 6.36 180 top
R13  33Ω  [R0402]  14.96 7.25 180 top
R14  100kΩ  [R0402]  10.89 14.5 90 top
R15  100kΩ  [R0402]  11.91 14.5 90 top
R16  100kΩ  [R0402]  13.94 14.5 90 top
R19  5.1kΩ  [R0402]  7.75 30.86 270 top
R20  5.1kΩ  [R0402]  10.8 31.87 0 top
SW1  GT-TC191A-H026-L60  [KEY-SMD_GT-TC191A-H026-L60]  48.26 10.79 90 top
U2  SYT01N05DWC  [DFN-2L_L1.0-W0.6-P0.65-BI-2]  7.75 29.08 270 top
U3  ES8311  [WQFN-20_L3.0-W3.0-P0.40-BL-EP1.7]  11.36 6.34 0 top
U4  NS4150B  [MSOP-8_L3.0-W3.0-P0.65-LS5.0-BL]  13.08 17.78 90 top
U5  ESP32-S3-WROOM-1-N16R8  [WIRELM-SMD_ESP32-S3-WROOM-1]  30.48 22.09 0 top
USB1  TYPE-C 16PIN 2MD(073)  [USB-C-SMD_TYPE-C-6PIN-2MD-073]  9.02 36.07 180 top

## Footprints (pads in the part's own frame, mm; a bottom-side part is the same pattern mirrored in y, then rotated)
C0402
  rrect 0.79x0.54 smd: 1(-0.545,0) 2(0.545,0)
C0402#3
  rect 0.79x0.54 smd: 1(-0.545,0) 2(0.545,0)
C0402#2
  rrect 0.4x0.6 smd: 1(-0.425,0) 2(0.425,0)
C0603
  rrect 0.8x0.9 smd: 1(-0.7,0) 2(0.7,0)
CONN-SMD_2P-P1.25_XUNPU_WAFER-MX1.25-2PWB
  rect 0.7x1.7 smd: 1(-0.625,1.25) 2(0.625,1.25)
  rect 1.8x2.5 smd: 3(3.075,-1.25) 4(-3.075,-1.25)
DFN-2L_L1.0-W0.6-P0.65-BI-2
  custom 0.41x0.6 smd: 1(-0.325,0)
  rect 0.4x0.6 smd: 2(0.325,0)
HDR-TH_2P-P2.54-V-M
  rect 2x2 hole 1.2: 1(-1.27,0)
  round 2 hole 1.2: 2(1.27,0)
KEY-SMD_GT-TC191A-H026-L60
  rect 0.7x0.6 smd: 1(-0.85,0.562) 2(0.85,0.562)
  rect 0.75x1.85 smd: 3(-2.325,-0.562) 4(2.325,-0.562)
L0402
  rect 0.4x0.6 smd: 1(-0.425,0) 2(0.425,0)
LED-SMD_L1.7-W0.6-RD
  rect 0.8x0.7 smd: 1(-0.9,0) 2(0.9,0)
MIC-SMD_4P-L2.8-W1.9-P1.01-TL
  rect 0.7x0.7 smd: 1(-0.505,0.965) 2(-0.505,-0.965) 3(0.505,-0.965) 4(0.505,0.965)
MSOP-8_L3.0-W3.0-P0.65-LS5.0-BL
  oval 0.364x1.692 smd: 1(-0.975,-2.146) 2(-0.325,-2.146) 3(0.325,-2.146) 4(0.975,-2.146) 5(0.975,2.146) 6(0.325,2.146) 7(-0.325,2.146) 8(-0.975,2.146)
Pad_e1495
  round 3 hole 2.1: 1(0,0)
Pad_e1540
  round 3 hole 2.1: 1(0,0)
R0402
  rect 0.4x0.6 smd: 1(-0.425,0) 2(0.425,0)
SOD-123_L2.8-W1.8-LS3.7-FD-1
  rect 1.05x1 smd: 1(-1.75,0) 2(1.75,0)
SOT-23-5_L3.0-W1.7-P0.95-LS2.8-BL
  rect 0.49x1.157 smd: 1(-0.95,-1.153) 2(0,-1.153) 3(0.95,-1.153)
  rect 0.49x1.175 smd: 4(0.95,1.153) 5(-0.95,1.153)
SOT-23-6_L2.9-W1.6-P0.95-LS2.8-BL
  rrect 0.532x1.072 smd: 1(-0.95,-1.149) 2(0,-1.149) 3(0.95,-1.149) 4(0.95,1.149) 5(0,1.149) 6(-0.95,1.149)
SOT-323-3_L2.0-W1.3-P1.30-LS2.1-BR
  rect 0.936x0.5 smd: 1(0.898,-0.65) 2(0.898,0.65) 3(-0.898,0)
USB-C-SMD_TYPE-C-6PIN-2MD-073
  rect 0.55x1.1 smd: 1(-3.2,2.375) 2(-2.4,2.375) 11(2.4,2.375) 12(3.2,2.375)
  rect 0.3x1.1 smd: 3(-1.75,2.375) 4(-1.25,2.375) 5(-0.75,2.375) 6(-0.25,2.375) 7(0.25,2.375) 8(0.75,2.375) 9(1.25,2.375) 10(1.75,2.375)
  oval 1.1x2 hole 0.6x1.5: 13(-4.325,1.825) 14(4.325,1.825)
  oval 1.2x1.8 hole 0.6x1.2: 13(-4.325,-2.375) 14(4.325,-2.375)
WIRELM-SMD_ESP32-S3-WROOM-1
  rect 1.5x0.9 smd: 1(-8.75,8.895) 2(-8.75,7.625) 3(-8.75,6.355) 4(-8.75,5.085) 5(-8.75,3.815) 6(-8.75,2.545) 7(-8.75,1.275) 8(-8.75,0.005) 9(-8.75,-1.265) 10(-8.75,-2.535) 11(-8.75,-3.805) 12(-8.75,-5.075) 13(-8.75,-6.345) 14(-8.75,-7.615) 27(8.75,-7.615) 28(8.75,-6.345) 29(8.75,-5.075) 30(8.75,-3.805) 31(8.75,-2.535) 32(8.75,-1.265) 33(8.75,0.005) 34(8.75,1.275) 35(8.75,2.545) 36(8.75,3.815) 37(8.75,5.085) 38(8.75,6.355) 39(8.75,7.625) 40(8.75,8.895)
  rect 0.9x1.5 smd: 15(-6.985,-8.895) 16(-5.715,-8.895) 17(-4.445,-8.895) 18(-3.175,-8.895) 19(-1.905,-8.895) 20(-0.635,-8.895) 21(0.635,-8.895) 22(1.905,-8.895) 23(3.175,-8.895) 24(4.445,-8.895) 25(5.715,-8.895) 26(6.985,-8.865)
  rect 0.9x0.9 smd: 41(-2.9,2.575) 41(-2.9,1.175) 41(-2.9,-0.225) 41(-1.5,2.575) 41(-1.5,1.175) 41(-1.5,-0.225) 41(-0.1,2.575) 41(-0.1,1.175) 41(-0.1,-0.225)
WQFN-20_L3.0-W3.0-P0.40-BL-EP1.7
  rect 0.2x0.8 smd: 1(-0.8,-1.5) 2(-0.4,-1.5) 3(0,-1.5) 4(0.4,-1.5) 5(0.8,-1.5) 11(0.8,1.5) 12(0.4,1.5) 13(0,1.5) 14(-0.4,1.5) 15(-0.8,1.5)
  rect 0.8x0.2 smd: 6(1.5,-0.8) 7(1.5,-0.4) 8(1.5,0) 9(1.5,0.4) 10(1.5,0.799) 16(-1.5,0.8) 17(-1.5,0.4) 18(-1.5,0) 19(-1.5,-0.4) 20(-1.5,-0.8)
  rect 1.7x1.7 smd: 21(0,0)
YDP128H005-V3
  oval 0.4x3 smd: 1(0,0) 2(0.8,0) 3(1.6,0) 4(2.4,0) 5(3.2,0) 6(4,0) 7(4.8,0) 8(5.6,0) 9(6.4,0) 10(7.2,0) 11(8,0) 12(8.8,0)

## Nets
As in the schematic.

Pads without a net: LDO1 4; NOREF 1; NOREF#2 1; U5 12 16 18 23 24 25 26 28 29 30 32 35 38 39; USB1 3 9

## Via types
v1: diameter 0.61, hole 0.305, Top Layer to Bottom Layer, 107 vias

## Routing (per net, layer and track width the routed paths; a pad name or vN(x,y) marks a point on that pad's centre or on a via; arc(x,y) is an arc through that point)
+3V3: length 24.4
  Top Layer w0.254: v1(45.72,14.6) 46.36,13.97 R2.2 ; C5.2 v1(8.03,21.51)
  Top Layer w0.381: R6.2 v1(30.14,8.5) ; R7.2 10.29,1.77 9.47,0.96 v1(9.02,0.96) R8.2 ; L2.2 v1(4.57,8.63) ; C1.2 16.16,30.26 C2.2 18.12,30.26 18.5,29.88 R1.1 21.56,29.88 U5.2 ; L1.1 v1(14.99,1.17) ; C5.2 8.03,22.88 8.06,22.92 LDO1.5 ; v1(14.22,11.3) 13.74,10.81 L4.1
  Top Layer w0.399: R6.2 29.75,7.58 29.54,7.79 C7.2 28.91,7.32 28.79,7.2 C8.2 28.82,6.62 LCD1.4
  Top Layer w0.508: v1(8.03,21.51) v1(8.03,20.7)
  vias: v1(19.19,30.6) v1(19.94,30.6)
+5V: length 48.4
  Top Layer w0.381: v1(16.89,20.82) 15.1,20.82 C28.1 14.14,20.81 C27.2 ; 10.93,18.1 12.14,18.1 12.82,18.78 C26.2 14.02,20.69
  Top Layer w0.399: D1.5 11.05,29.08 10.72,28.75 v1(8.8,28.75) U2.2 ; U2.2 7.7,28.71 C4.2 ; U2.2 7.17,28.75 6.89,28.47 D2.2
  Top Layer w0.49: LDO1.1 8.06,26.86 7.7,27.22 C4.2 6.86,27.55 6.16,26.86 LDO1.3
  Top Layer w0.635: v1(3.17,23.36) 3.82,23.36 4.84,22.33 FPC1.4
  VDD w0.762: v1(9.02,29.84) 10.92,29.84 12.01,28.75 ; v1(3.17,23.36) 8.57,28.75 v1(8.8,28.75) 12.01,28.75 ; 12.01,28.75 13.97,26.79 13.97,23.74 v1(16.89,20.82) v1(16.89,19.93)
GND: length 7.6
  Top Layer w0.254: 10.93,17.45 12.37,17.45 14.22,19.3 16.13,19.3 16.64,18.79 v1(16.64,17.9)
  vias: v1(1.4,34.03) v1(1.4,33.14) v1(1.4,32.25) v1(1.4,31.36) v1(1.4,28.82) v1(1.4,27.94) v1(1.4,27.05) v1(1.4,26.16) v1(1.4,13.08) v1(1.4,12.19) v1(1.4,11.3) v1(1.4,10.41) v1(1.4,8.5) v1(1.4,7.62) v1(1.4,6.73) v1(1.4,5.84) v1(10.03,24.63) v1(10.03,23.62) v1(16.26,10.41) v1(16.26,9.39) v1(16.6,38.95) v1(17.49,38.95) v1(17.65,14.22) v1(17.65,1.52) v1(18.29,13.58) v1(18.38,38.95) v1(18.54,1.52) v1(19.27,38.95) v1(19.43,1.52) v1(19.81,34.29) v1(19.81,33.4) v1(19.81,32.51) v1(20.32,1.52) v1(29.21,30.22) v1(30.1,30.22) v1(30.99,30.22) v1(31.88,30.22) v1(34.67,20.32) v1(34.67,19.43) v1(34.67,18.54) v1(34.67,17.65) v1(35.43,1.52) v1(35.94,20.32) v1(35.94,19.43) v1(35.94,18.54) v1(35.94,17.65) v1(36.32,1.52) v1(37.21,1.52) v1(38.1,1.52) v1(40.64,1.52) v1(41.53,1.52) v1(41.91,17.65) v1(41.91,16.38) v1(42.42,1.52) v1(42.67,38.48) v1(42.93,24.51) v1(43.31,33.02) v1(43.31,1.52) v1(43.56,25.14) v1(43.94,38.48) v1(44.87,29.61) v1(45.34,38.48) v1(45.97,19.05) v1(46.61,7.23) v1(46.61,6.34) v1(46.61,5.46) v1(46.61,4.57) v1(46.86,19.55) v1(46.86,18.54) v1(47.37,26.16) v1(47.37,25.27)
VBUS: length 28.2
  Top Layer w0.508: v1(4.57,31.97) D2.1 6.22,32.51 6.62,32.91 USB1.11 ; USB1.2 11.42,32.98 12.28,32.13 v1(12.95,32.13)
  VDD w0.762: v1(4.57,31.97) 3.71,31.97 2.92,32.76 2.92,35.43 3.81,36.32 13.97,36.32 14.86,35.43 14.86,32.89 14.1,32.13 v1(12.95,32.13)
CTRL: length 17.2
  Top Layer w0.254: U4.1 14.52,16.8 13.97,16.25 13.97,14.95 R16.2 14.79,14.93 17.91,11.81 25.4,11.81 26.04,12.44 U5.17
DIN: length 16.1
  Top Layer w0.254: R13.1 15.4,7.23 16.51,7.23 20.32,11.04 27.18,11.04 28.58,12.44 U5.19
DOUT: length 19.4
  Top Layer w0.254: U5.21 31.11,12.44 28.19,9.52 20.95,9.52 16.9,5.47 R11.1
IO0: length 11.7
  Top Layer w0.254: R2.1 46.36,11.6 C6.2 ; U5.27 39.23,14.47 44.07,14.47 44.83,13.71 44.83,12.44 45.7,11.57 C6.2 ; C6.2 47.63,11.57 SW1.2
LED: length 11.8
  Top Layer w0.254: U5.31 43.43,19.56 48.16,14.82 LED1.2
LED_BL: length 17.5
  Top Layer w0.254: v1(32.51,15.11) 24.38,15.11 23.49,14.22 U5.15
  Top Layer w0.5: Q1.1 v1(32.57,9.27)
  Bottom Layer w0.254: v1(32.51,15.11) 32.51,9.33 v1(32.57,9.27)
LEDA: length 4.2
  Top Layer w0.254: LCD1.3 29.62,5.11 30.14,5.63 R6.1
LEDK: length 4.1
  Top Layer w0.399: LCD1.2 30.42,4.38 31.92,5.88 Q1.3
LRCK: length 17.7
  Top Layer w0.254: U5.20 29.84,12.44 27.69,10.28 20.57,10.28 16.65,6.36 R12.1
MCLK: length 31
  Top Layer w0.254: v1(11.81,1.39) 11.3,1.9 R9.1 ; U5.6 20.83,24.64 v1(19.94,23.74)
  Bottom Layer w0.254: v1(11.81,1.39) 11.81,18.92 16.64,23.74 v1(19.94,23.74)
RXD: length 14.6
  Top Layer w0.635: H1.2 46.61,35.05 43.31,31.75 43.31,27.05 42.16,25.9 39.23,25.9 U5.36
SCL: length 37
  Top Layer w0.201: R7.1 v1(10.29,3.93) 10.56,4.21 U3.1
  Top Layer w0.254: v1(19.43,26.16) 20.45,27.18 21.73,27.18
  Bottom Layer w0.254: v1(19.43,26.16) 15.37,26.16 7.75,18.54 7.75,3.93 8.38,3.3 9.65,3.3 v1(10.29,3.93)
SCLK: length 21
  Top Layer w0.254: R10.1 17.15,4.57 21.34,8.76 28.7,8.76 32.39,12.44 U5.22
SDA: length 32.3
  Top Layer w0.201: 9.14,3.21 v1(9.14,4.86) 9.14,5.72 9.37,5.94 U3.19
  Top Layer w0.254: v1(19.43,24.89) 20.45,25.91 U5.5
  Bottom Layer w0.254: v1(9.14,4.86) 9.14,18.03 16,24.89 v1(19.43,24.89)
SPI_CS: length 22.4
  Top Layer w0.254: U5.8 24.06,22.1 24.07,22.09 24.26,22.09 v1(25.27,21.08) ; LCD1.8 v1(25.62,5.96)
  Bottom Layer w0.254: v1(25.27,21.08) 25.62,20.73 v1(25.62,5.96)
SPI_DC: length 24.5
  Top Layer w0.254: v1(26.04,22.47) 25.14,23.37 U5.7 ; LCD1.7 v1(26.42,6.73)
  Bottom Layer w0.254: v1(26.04,22.47) 26.42,22.09 v1(26.42,6.73)
SPI_MOSI: length 18.5
  Top Layer w0.254: LCD1.10 v1(24.02,5.96) ; U5.10 22.98,19.56 v1(24,18.54)
  Bottom Layer w0.254: v1(24.02,5.96) 24,5.98 v1(24,18.54)
SPI_RESET: length 16.6
  Top Layer w0.254: U5.11 22.35,18.29 v1(23.37,17.27) ; LCD1.11 v1(23.22,6.73)
  Bottom Layer w0.254: v1(23.37,17.27) 23.22,17.12 v1(23.22,6.73)
SPI_SCK: length 20.4
  Top Layer w0.254: U5.9 23.62,20.83 v1(24.64,19.81) ; LCD1.9 v1(24.82,6.73)
  Bottom Layer w0.254: v1(24.64,19.81) 24.82,19.62 v1(24.82,6.73)
TXD: length 11.4
  Top Layer w0.635: 39.23,27.18 40.77,27.18 41.53,27.94 41.53,32.63 44.07,35.17 44.07,35.68
USB_DN_IN: length 9
  Top Layer w0.299: USB1.7 8.77,34.68 9.02,34.92 9.52,34.92 9.77,34.67 USB1.5 9.77,31.37 10.03,31.11 11.68,31.11 12,30.8 D1.4
USB_DP_IN: length 6.9
  Top Layer w0.299: 8.27,32.74 8.27,31.98 10.1,30.16 D1.6 ; 8.27,32.74 USB1.8 ; 8.27,32.74 8.51,32.51 9.02,32.51 9.27,32.77 USB1.6
USB_N: length 18.5
  Top Layer w0.254: D1.3 12,26.73 13.21,25.52 16.64,25.52 18.92,23.24 18.92,17.14 20.32,15.74 21.73,15.74 U5.13
USB_P: length 20.9
  Top Layer w0.254: U5.14 19.81,14.48 17.65,16.63 17.65,22.6 15.87,24.38 12.45,24.38 10.1,26.73 D1.1
$1N3371: length 2.2
  Top Layer w0.201: U3.18 9.27,6.34 8.45,5.52 C9.1
$1N3372: length 2
  Top Layer w0.201: C10.1 8,6.47 8.38,6.47 8.65,6.74 U3.17
$1N3373: length 2
  Top Layer w0.201: C15.1 8.37,7.5 8.73,7.14 U3.16
$1N3374: length 2.3
  Top Layer w0.201: U3.15 10.06,7.84 9.21,8.69 C16.1
$1N3375: length 1.8
  Top Layer w0.201: C18.1 10.11,9.19 10.96,8.34 U3.14
$1N3376: length 1.6
  Top Layer w0.201: C19.1 11.02,8.92 11.36,8.57 U3.13
$1N3377: length 1.5
  Top Layer w0.201: C22.1 11.92,8.74 11.79,8.61 11.79,7.86 U3.12
$1N3378: length 2.7
  Top Layer w0.201: U3.11 12.82,8.5 C24.1
  Top Layer w0.254: L4.2 13.73,9.32 C24.1
$1N3384: length 1.8
  Top Layer w0.201: U3.2 10.96,4.02 11.3,3.68 11.3,3.34 11.18,3.21
$1N3385: length 7.3
  Top Layer w0.201: U3.4 11.76,4.23 11.94,4.06 12.7,4.06 13.01,3.75 C12.2 12.93,3.45 12.57,3.81 11.81,3.81 11.36,4.25 U3.3
  Top Layer w0.381: C12.2 13.01,2.43 C11.2 13.01,2.19 13.01,1.17
$1N3387: length 2.1
  Top Layer w0.201: U3.6 13.83,4.57 R10.2
$1N3388: length 1.9
  Top Layer w0.201: R11.2 14.09,5.47 13.61,5.94 U3.7
$1N3389: length 1.7
  Top Layer w0.201: R12.2 14.52,6.34 U3.8
$1N3390: length 1.9
  Top Layer w0.201: U3.9 13.48,6.74 13.99,7.25 R13.2
$1N3393: length 7.5
  Top Layer w0.381: L2.1 4.63,6.75 C14.2 4.63,4.84 C13.2 3.71,4.72 3.3,4.31 3.3,1.77 3.73,1.34 MIC1.4
$1N3395: length 5.3
  Top Layer w0.254: C9.2 7.15,2.19 6.3,1.34 MIC1.1
$1N3413: length 6.2
  Top Layer w0.254: U4.4 14.31,18.75 10.89,15.33 R14.2
$1N3415: length 5.1
  Top Layer w0.254: U4.3 14.3,18.1 11.91,15.71 R15.2
$1N3417: length 1.6
  Top Layer w0.254: C23.2 12,10.98 11.92,10.9 11.92,10.17
$1N3418: length 4
  Top Layer w0.254: C25.1 12.93,16.1 14.28,17.45 U4.2
$1N3429: length 3.7
  Top Layer w0.254: FPC1.2 7.34,17.14 8.51,17.14 8.85,16.8 C21.1 10.93,16.8 10.93,16.8
$1N3430: length 3.7
  Top Layer w0.254: FPC1.1 8.49,18.39 8.85,18.75 C17.2 10.93,18.75 10.93,18.75
$1N5880: length 1.6
  Top Layer w0.254: C19.2 11.02,10.82 10.86,10.98 C20.2
$1N5884: length 1.3
  Top Layer w0.254: C20.1 10.86,13.52 10.89,13.56 R14.1
$1N5889: length 1.3
  Top Layer w0.254: C23.1 12,13.52 11.91,13.61 R15.1
$1N5925: length 7.5
  Top Layer w0.254: C10.2 6.86,6.48 6.35,5.96 6.35,5.08 6,4.72 C13.1 ; C13.1 5.6,3.31 MIC1.2 MIC1.3 ; C13.1 5.6,5.19 5.48,5.31 C14.1 5.48,6.23 5.59,6.34 L3.1
$1N9910: length 2.6
  Top Layer w0.254: R19.1 7.75,32.13 7.27,32.6 USB1.10
$1N9913: length 1.9
  Top Layer w0.254: USB1.4 10.29,33.68 10.29,32.76 10.37,32.68 R20.1
$1N10459: length 1.2
  Top Layer w0.254: LED1.1 49.04,17.25 48.96,17.33 R4.1
$1N10799: length 3.7
  Top Layer w0.381: R1.2 C3.1 21.52,28.23 U5.3

## Copper pours and planes (outline as drawn; the poured copper is in the pictures)
+3V3 on Top Layer: 13.44,11.51 14.44,11.51 14.44,9.96 13.44,9.96
+3V3 on Top Layer: 15.9,30.96 22.48,30.96 22.48,29.27 15.9,29.27
+3V3 on Top Layer: 7.75,24.38 8.38,24.38 8.38,21.33 7.75,21.33
+3V3 on Top Layer: 28.51,8.5 30.45,8.5 30.45,6.47 28.51,6.47
+3V3 on VDD: -2.67,42.67 53.59,42.67 53.59,-2.67 -2.67,-2.67
+5V on Top Layer: 5.72,29.05 8.8,29.05 8.8,25.46 5.72,25.46
+5V on Top Layer: 10.93,21.09 16.89,21.09 16.89,17.89 10.93,17.89
+5V on VDD: 8.29,30.16 12.33,30.16 12.33,28.44 8.29,28.44
GND on Top Layer: -2.29,42.03 52.45,42.03 52.45,-2.16 -2.29,-2.16
GND on Bottom Layer: -2.42,42.19 52.21,42.19 52.21,-2.02 -2.42,-2.02
GND on GND: -2.03,41.91 51.82,41.91 51.82,-1.91 -2.03,-1.91
$1N3378 on Top Layer: 12.06,9.52 14.04,9.52 14.04,7.44 12.06,7.44
$1N3385 on Top Layer: 11.26,4.31 13.28,4.31 13.28,0.86 11.26,0.86

Small or netless copper shapes (teardrops, artwork), in the pictures only: 213 on Top Layer, 18 on Bottom Layer, 2 on VDD

## Text on the board
Top Silkscreen Layer: Down | 2025-2-8 | V1.0 | WuYeming
